# Altium schematic sheet READ_1.SchDoc: FMC-320U - MODELO A - PCB 1
size A4; SheetNumber: 1; SheetTotal: 7; thisVersion: 1; ThisRevision: 2; ThisRelease: 1
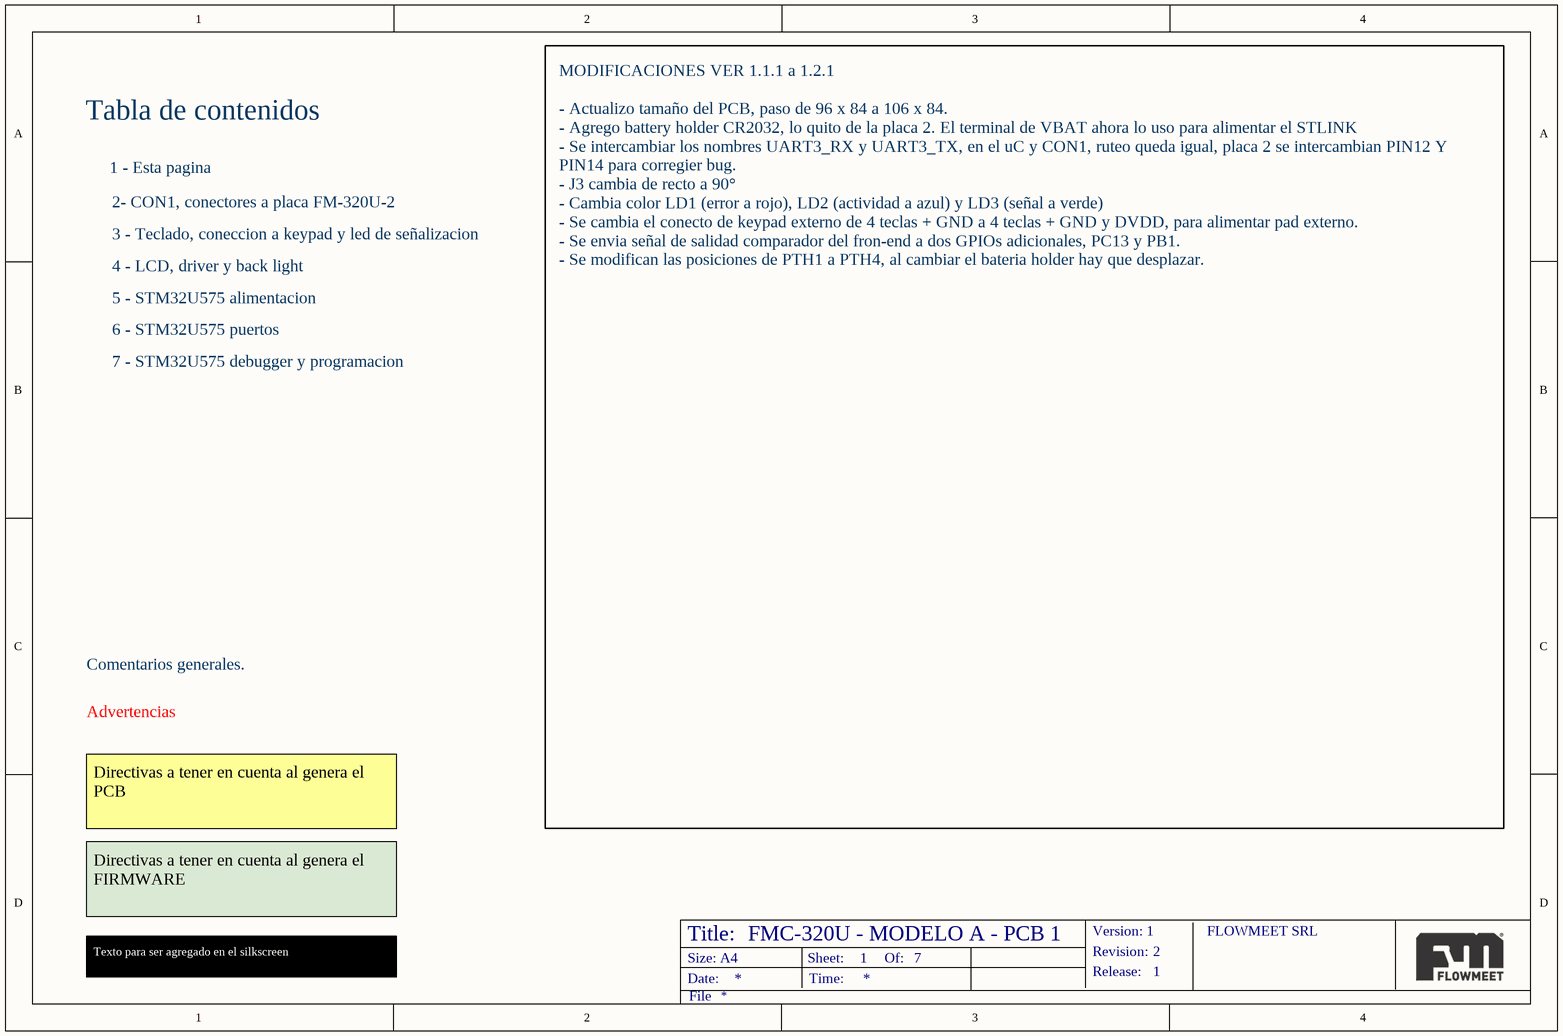
[diagram p0: READ_1.SchDoc]

## Notes on the sheet
- Tabla de contenidos
- 1 - Esta pagina
- 2- CON1, conectores a placa FM-320U-2
- 3 - Teclado, coneccion a keypad y led de señalizacion
- 4 - LCD, driver y back light
- 5 - STM32U575 alimentacion
- 6 - STM32U575 puertos
- 7 - STM32U575 debugger y programacion
- Comentarios generales.
- Advertencias
- Directivas a tener en cuenta al genera el PCB
- MODIFICACIONES VER 1.1.1 a 1.2.1
  - Actualizo tamaño del PCB, paso de 96 x 84 a 106 x 84.
  - Agrego battery holder CR2032, lo quito de la placa 2. El terminal de VBAT ahora lo uso para alimentar el STLINK
  - Se intercambiar los nombres UART3_RX y UART3_TX, en el uC y CON1, ruteo queda igual, placa 2 se intercambian PIN12 Y PIN14 para corregier bug.
  - J3 cambia de recto a 90°
  - Cambia color LD1 (error a rojo), LD2 (actividad a azul) y LD3 (señal a verde)
  - Se cambia el conecto de keypad externo de 4 teclas + GND a 4 teclas + GND y DVDD, para alimentar pad externo.
  - Se envia señal de salidad comparador del fron-end a dos GPIOs adicionales, PC13 y PB1.
  - Se modifican las posiciones de PTH1 a PTH4, al cambiar el bateria holder hay que desplazar.
- Directivas a tener en cuenta al genera el FIRMWARE
- Texto para ser agregado en el silkscreen
- Title:
- Size: A4
- Date:
- Sheet:
- Time:
- Of:
- Version:
- Revision:
- Release:
- FLOWMEET SRL
- File